# Altium schematic sheet 三色墨水瓶.SchDoc
size A3
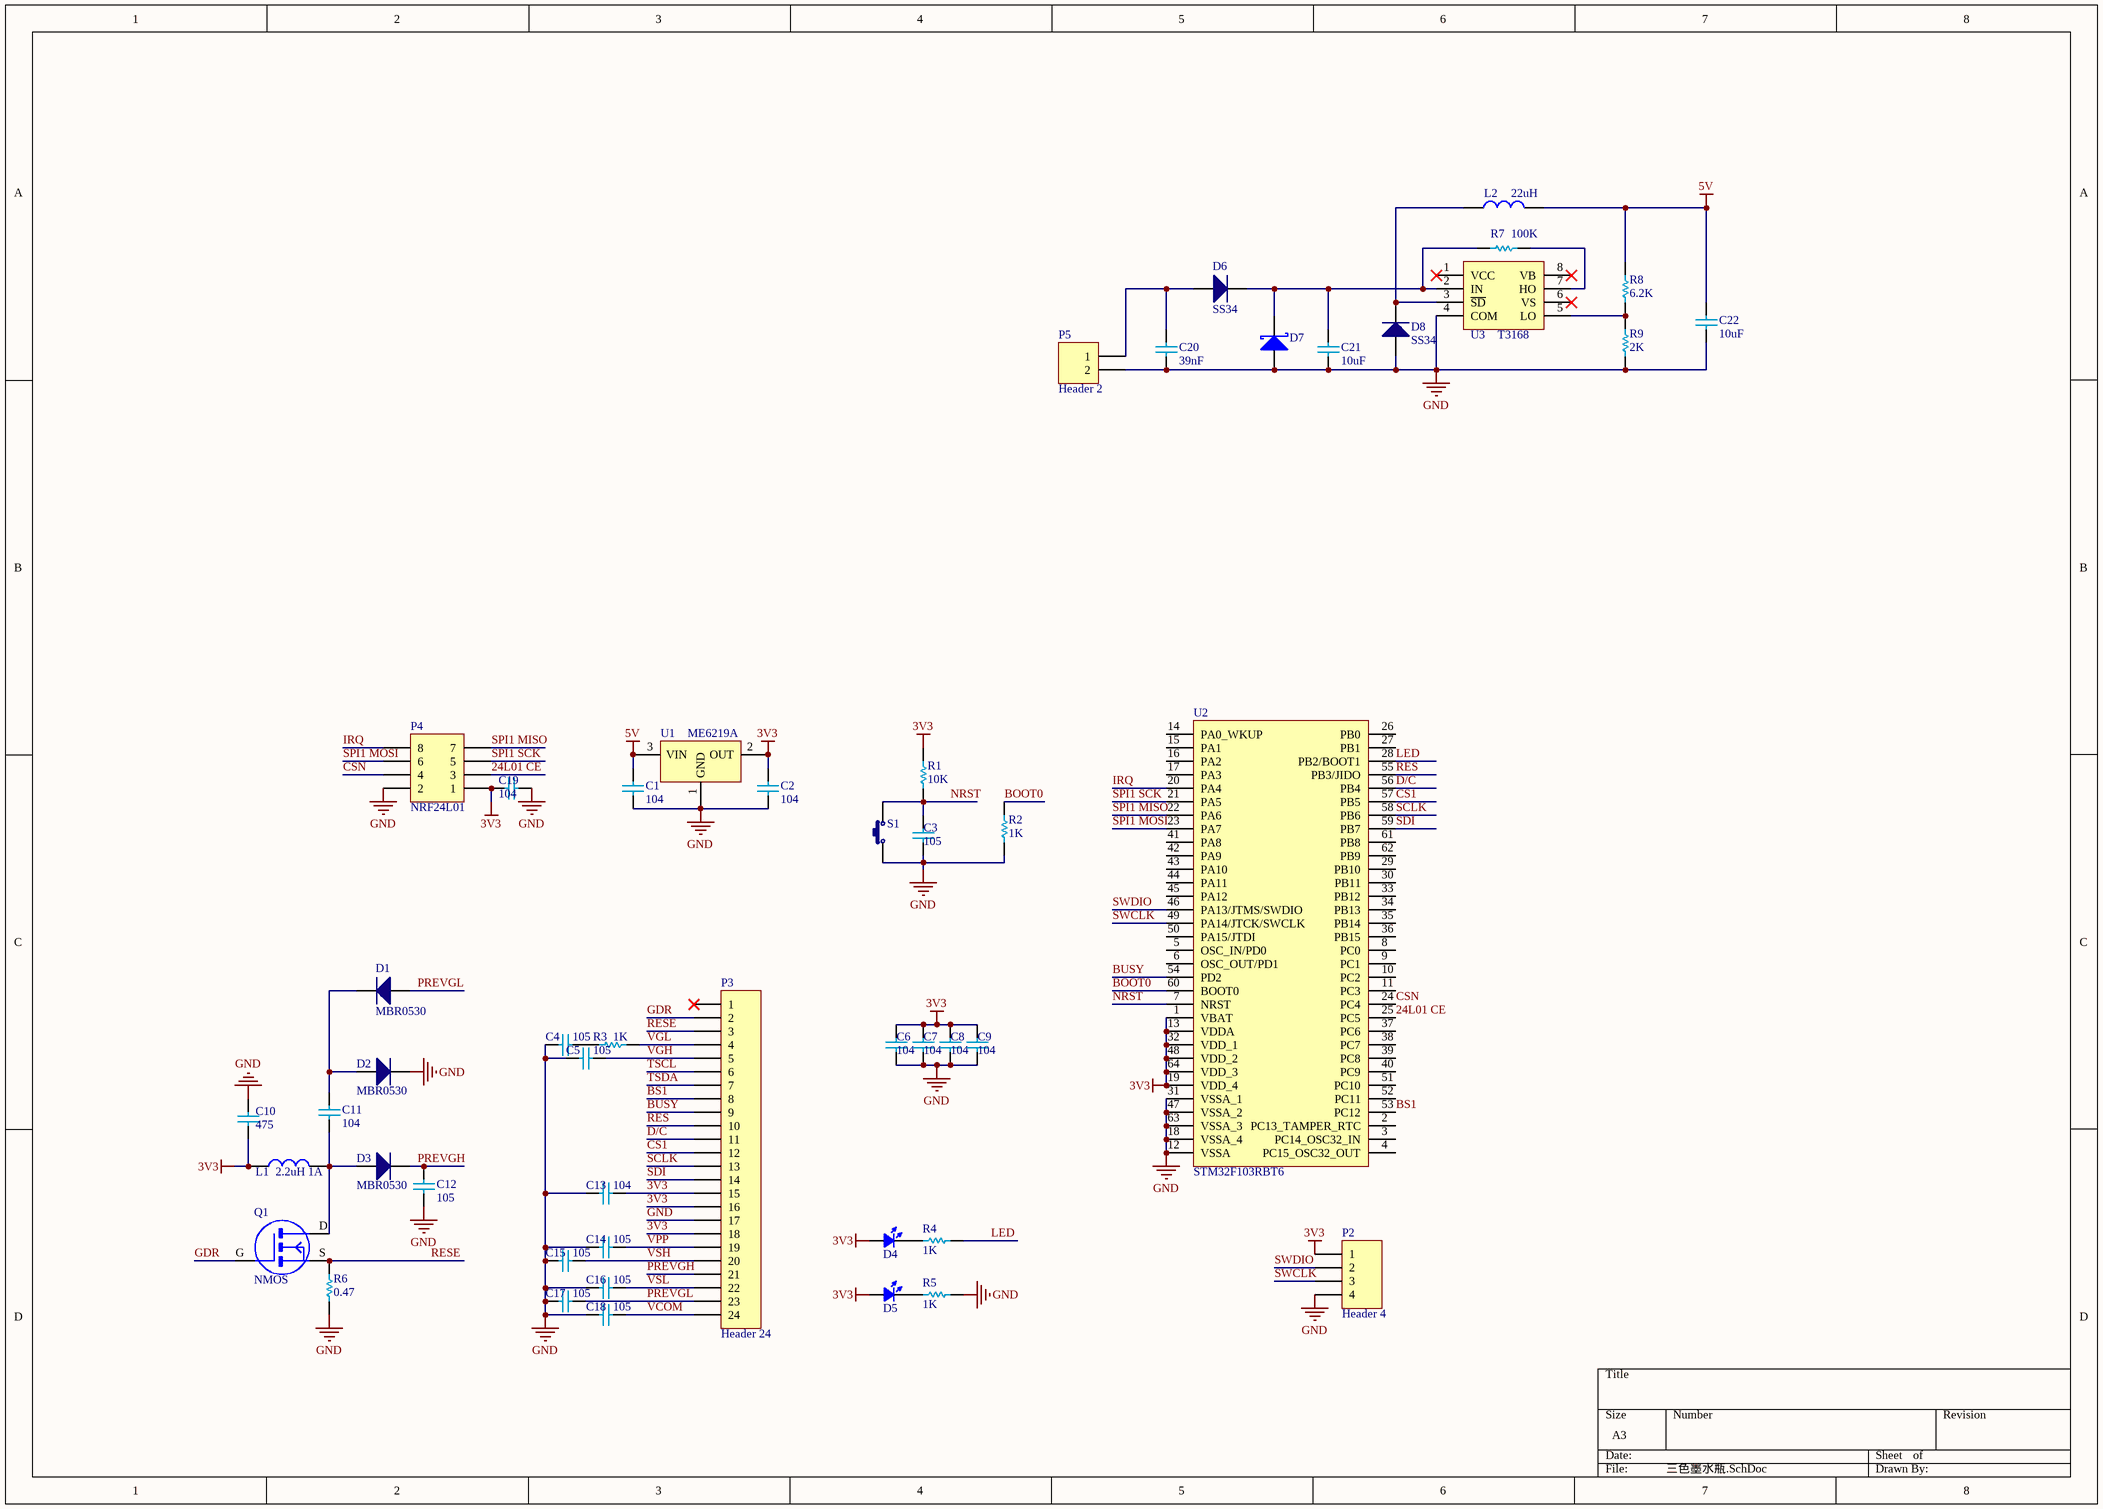
[diagram p0: 三色墨水瓶.SchDoc]

## Parts
C1  value 104  [0805C]  (hidden comment: CAP_1)
C2  value 104  [0805C]  (hidden comment: CAP_1)
C3  value 105  [0805C]  (hidden comment: CAP_1)
C4  value 105  [0805C]  (hidden comment: CAP_1)
C5  value 105  [0805C]  (hidden comment: CAP_1)
C6  value 104  [0805C]  (hidden comment: CAP_1)
C7  value 104  [0805C]  (hidden comment: CAP_1)
C8  value 104  [0805C]  (hidden comment: CAP_1)
C9  value 104  [0805C]  (hidden comment: CAP_1)
C10  value 475  [0805C]  (hidden comment: CAP_1)
C11  value 104  [0805C]  (hidden comment: CAP_1)
C12  value 105  [0805C]  (hidden comment: CAP_1)
C13  value 104  [0805C]  (hidden comment: CAP_1)
C14  value 105  [0805C]  (hidden comment: CAP_1)
C15  value 105  [0805C]  (hidden comment: CAP_1)
C16  value 105  [0805C]  (hidden comment: CAP_1)
C17  value 105  [0805C]  (hidden comment: CAP_1)
C18  value 105  [0805C]  (hidden comment: CAP_1)
C19  value 104  [0805C]  (hidden comment: CAP_1)
C20  value 39nF  [0805C]  (hidden comment: CAP_1)
C21  value 10uF  [0805C]  (hidden comment: CAP_1)
C22  value 10uF  [0805C]  (hidden comment: CAP_1)
D1  MBR0530  [LC-SOD-123]
D2  MBR0530  [LC-SOD-123]
D3  MBR0530  [LC-SOD-123]
D4  LED  [0805C]  (value not drawn)
D5  LED  [0805C]  (value not drawn)
D6  SS34  [DO-214AA]
D7  Diode Schottky  [0805R]  (value not drawn)
D8  SS34  [DO-214AA]
L1  2.2uH 1A  [1210R]
L2  22uH  [R2512]
P2  Header 4  [HDR1X4]
P3  Header 24  [FPC 24P]
P4  NRF24L01  [NRF24L01M]
P5  Header 2  [HDR1X2]
Q1  NMOS  [SOT-23-MOS]
R1  Values: 10K  [0805R]  (hidden comment: RES)
R2  Values: 1K  [0805R]  (hidden comment: RES)
R3  Values: 1K  [0805R]  (hidden comment: RES)
R4  Values: 1K  [0805R]  (hidden comment: RES)
R5  Values: 1K  [0805R]  (hidden comment: RES)
R6  Values: 0.47  [0805R]  (hidden comment: RES)
R7  Values: 100K  [0805R]  (hidden comment: RES)
R8  Values: 6.2K  [0805R]  (hidden comment: RES)
R9  Values: 2K  [0805R]  (hidden comment: RES)
S1  Switch  [SW_PB2_A1]  (value not drawn)
U1  ME6219A  [LC-SOT-23(SOT-23-3)]
U2  STM32F103RBT6  [LQFP-64]
U3  T3168  [SOIC-8]

## Nets
3V3: C2.2 C6.2 C7.2 C8.2 C9.2 C10.2 C13.2 C19.1 D4.1(A) D5.1(A) L1.1 P2.1 P3.15 P3.16 P3.18 P4.1 R1.1 U1.2(OUT) U2.1(VBAT) U2.13(VDDA) U2.19(VDD_4) U2.32(VDD_1) U2.48(VDD_2) U2.64(VDD_3)
5V: C1.2 C22.2 L2.2 R8.2 U1.3(VIN)
GND: C1.1 C2.1 C3.2 C4.1 C5.1 C6.1 C7.1 C8.1 C9.1 C10.1 C12.1 C13.1 C14.1 C15.1 C16.1 C17.1 C18.1 C19.2 C20.1 C21.1 C22.1 D2.2 D7.1(A) D8.1 P2.4 P3.17 P4.2 P5.2 R2.2 R5.2 R6.1 R9.1 S1.1 U1.1(GND) U2.12(VSSA) U2.18(VSSA_4) U2.31(VSSA_1) U2.47(VSSA_2) U2.63(VSSA_3) U3.4(COM)
24L01 CE: P4.3 U2.25(PC5)
BOOT0: R2.1 U2.60(BOOT0)
BS1: P3.8 U2.53(PC12)
BUSY: P3.9 U2.54(PD2)
CS1: P3.12 U2.57(PB5)
CSN: P4.4 U2.24(PC4)
D/C: P3.11 U2.56(PB4)
GDR: P3.2 Q1.G
IRQ: P4.8 U2.20(PA4)
LED: R4.2 U2.28(PB2/BOOT1)
NRST: C3.1 R1.2 S1.2 U2.7(NRST)
PREVGH: C12.2 D3.2 P3.21
PREVGL: C17.2 D1.1 P3.23
RES: P3.10 U2.55(PB3/JIDO)
RESE: P3.3 Q1.S R6.2
SCLK: P3.13 U2.58(PB6)
SDI: P3.14 U2.59(PB7)
SPI1 MISO: P4.7 U2.22(PA6)
SPI1 MOSI: P4.6 U2.23(PA7)
SPI1 SCK: P4.5 U2.21(PA5)
SWCLK: P2.3 U2.49(PA14/JTCK/SWCLK)
SWDIO: P2.2 U2.46(PA13/JTMS/SWDIO)
TSCL: P3.6
TSDA: P3.7
VCOM: C18.2 P3.24
VGH: C5.2 P3.5
VGL: P3.4 R3.2
VPP: C14.2 P3.19
VSH: C15.2 P3.20
VSL: C16.2 P3.22
NetC4_2: C4.2 R3.1
NetC11_1: C11.1 D3.1 L1.2 Q1.D
NetC11_2: C11.2 D1.2 D2.1
NetC20_2: C20.2 D6.1 P5.1
NetC21_2: C21.2 D6.2 D7.2(K) R7.1 U3.2(IN)
NetD4_2: D4.2(K) R4.1
NetD5_2: D5.2(K) R5.1
NetD8_2: D8.2 L2.1 U3.3(~{SD})
NetR7_2: R7.2 U3.7(HO)
NetR8_1: R8.1 R9.2 U3.5(LO)

Not connected (* = marked no-connect by the designer): P3 1*; U2 2(PC13_TAMPER_RTC) 3(PC14_OSC32_IN) 4(PC15_OSC32_OUT) 5(OSC_IN/PD0) 6(OSC_OUT/PD1) 8(PC0) 9(PC1) 10(PC2) 11(PC3) 14(PA0_WKUP) 15(PA1) 16(PA2) 17(PA3) 26(PB0) 27(PB1) 29(PB10) 30(PB11) 33(PB12) 34(PB13) 35(PB14) 36(PB15) 37(PC6) 38(PC7) 39(PC8) 40(PC9) 41(PA8) 42(PA9) 43(PA10) 44(PA11) 45(PA12) 50(PA15/JTDI) 51(PC10) 52(PC11) 61(PB8) 62(PB9); U3 1(VCC)* 6(VS)* 8(VB)*

## Library data of the parts
D1-D3 D6 D8 = Diode
L1 L2 = Inductor
P2 = Header 4: Header, 4-Pin; LatestRevisionDate: 17-Jul-2002; LatestRevisionNote: Re-released for DXP Platform.; Publisher: Altium Limited
P3 = Header 24: Header, 24-Pin; LatestRevisionDate: 17-Jul-2002; LatestRevisionNote: Re-released for DXP Platform.; Publisher: Altium Limited
P4 = Header 4X2: Header, 4-Pin, Dual row; LatestRevisionDate: 17-Jul-2002; LatestRevisionNote: Re-released for DXP Platform.; Publisher: Altium Limited
P5 = Header 2: Header, 2-Pin; LatestRevisionDate: 17-Jul-2002; LatestRevisionNote: Re-released for DXP Platform.; Publisher: Altium Limited
U3 = IR2104